# Altium schematic sheet Top.SchDoc
size A4; SheetNumber: 2; SheetTotal: 5
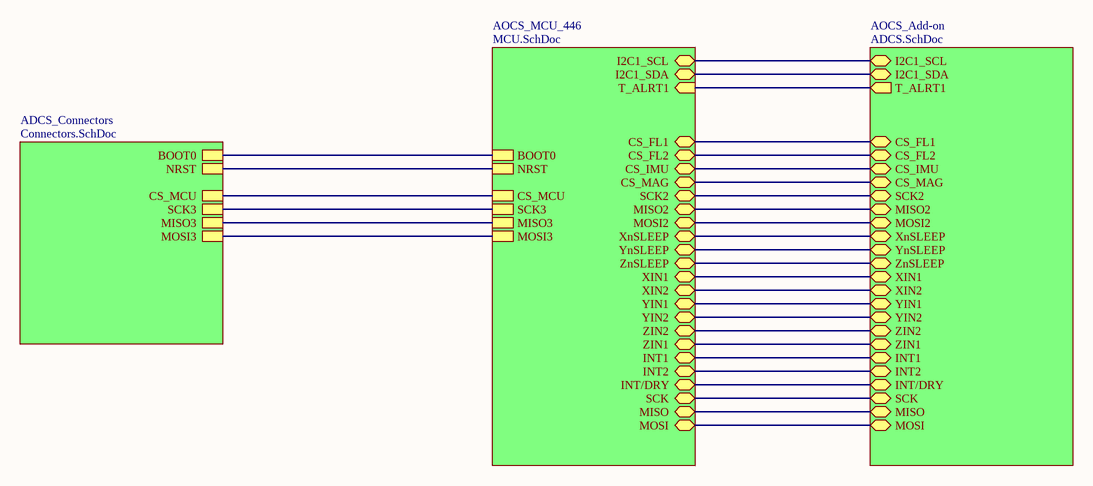
[diagram p0: Top.SchDoc]

## Sub-sheets
ADCS_Connectors = Connectors.SchDoc: NRST, BOOT0, CS_MCU, SCK3, MISO3, MOSI3
AOCS_Add-on = ADCS.SchDoc: I2C1_SCL (bidir), I2C1_SDA (bidir), T_ALRT1 (out), CS_FL2 (bidir), CS_FL1 (bidir), CS_IMU (bidir), CS_MAG (bidir), SCK2 (bidir), MISO2 (bidir), MOSI2 (bidir), YnSLEEP (bidir), XnSLEEP (bidir), ZnSLEEP (bidir), XIN1 (bidir), XIN2 (bidir), YIN1 (bidir), YIN2 (bidir), ZIN2 (bidir), INT2 (bidir), ZIN1 (bidir), INT1 (bidir), INT/DRY (bidir), SCK (bidir), MISO (bidir), MOSI (bidir)
AOCS_MCU_446 = MCU.SchDoc: NRST, BOOT0, I2C1_SCL (bidir), I2C1_SDA (bidir), CS_FL2 (bidir), CS_FL1 (bidir), CS_IMU (bidir), CS_MAG (bidir), SCK2 (bidir), MISO2 (bidir), T_ALRT1 (in), CS_MCU, SCK3, MISO3, MOSI3, MOSI2 (bidir), XnSLEEP (bidir), YnSLEEP (bidir), ZnSLEEP (bidir), XIN1 (bidir), XIN2 (bidir), YIN1 (bidir), YIN2 (bidir), ZIN2 (bidir), INT1 (bidir), ZIN1 (bidir), INT2 (bidir), INT/DRY (bidir), SCK (bidir), MOSI (bidir), MISO (bidir)

## Nets
(unnamed): sheet AOCS_Add-on/I2C1_SCL, sheet AOCS_MCU_446/I2C1_SCL
(unnamed): sheet AOCS_Add-on/I2C1_SDA, sheet AOCS_MCU_446/I2C1_SDA
(unnamed): sheet AOCS_Add-on/T_ALRT1, sheet AOCS_MCU_446/T_ALRT1
(unnamed): sheet AOCS_Add-on/CS_FL2, sheet AOCS_MCU_446/CS_FL2
(unnamed): sheet AOCS_Add-on/CS_FL1, sheet AOCS_MCU_446/CS_FL1
(unnamed): sheet AOCS_Add-on/CS_IMU, sheet AOCS_MCU_446/CS_IMU
(unnamed): sheet AOCS_Add-on/CS_MAG, sheet AOCS_MCU_446/CS_MAG
(unnamed): sheet AOCS_Add-on/SCK2, sheet AOCS_MCU_446/SCK2
(unnamed): sheet AOCS_Add-on/MISO2, sheet AOCS_MCU_446/MISO2
(unnamed): sheet AOCS_Add-on/MOSI2, sheet AOCS_MCU_446/MOSI2
(unnamed): sheet AOCS_Add-on/YnSLEEP, sheet AOCS_MCU_446/YnSLEEP
(unnamed): sheet AOCS_Add-on/XnSLEEP, sheet AOCS_MCU_446/XnSLEEP
(unnamed): sheet AOCS_Add-on/ZnSLEEP, sheet AOCS_MCU_446/ZnSLEEP
(unnamed): sheet AOCS_Add-on/XIN1, sheet AOCS_MCU_446/XIN1
(unnamed): sheet AOCS_Add-on/XIN2, sheet AOCS_MCU_446/XIN2
(unnamed): sheet AOCS_Add-on/YIN1, sheet AOCS_MCU_446/YIN1
(unnamed): sheet AOCS_Add-on/YIN2, sheet AOCS_MCU_446/YIN2
(unnamed): sheet AOCS_Add-on/ZIN2, sheet AOCS_MCU_446/ZIN2
(unnamed): sheet AOCS_Add-on/INT2, sheet AOCS_MCU_446/INT2
(unnamed): sheet AOCS_Add-on/ZIN1, sheet AOCS_MCU_446/ZIN1
(unnamed): sheet AOCS_Add-on/INT1, sheet AOCS_MCU_446/INT1
(unnamed): sheet AOCS_Add-on/INT/DRY, sheet AOCS_MCU_446/INT/DRY
(unnamed): sheet AOCS_Add-on/SCK, sheet AOCS_MCU_446/SCK
(unnamed): sheet AOCS_Add-on/MISO, sheet AOCS_MCU_446/MISO
(unnamed): sheet AOCS_Add-on/MOSI, sheet AOCS_MCU_446/MOSI
(unnamed): sheet ADCS_Connectors/NRST, sheet AOCS_MCU_446/NRST
(unnamed): sheet ADCS_Connectors/BOOT0, sheet AOCS_MCU_446/BOOT0
(unnamed): sheet ADCS_Connectors/CS_MCU, sheet AOCS_MCU_446/CS_MCU
(unnamed): sheet ADCS_Connectors/SCK3, sheet AOCS_MCU_446/SCK3
(unnamed): sheet ADCS_Connectors/MISO3, sheet AOCS_MCU_446/MISO3
(unnamed): sheet ADCS_Connectors/MOSI3, sheet AOCS_MCU_446/MOSI3